# EAGLE design xiao-waveshare (EAGLE 9.6.2)
Xiao ESP32-C3 + Waveshare 4.2" E-ink Display Board
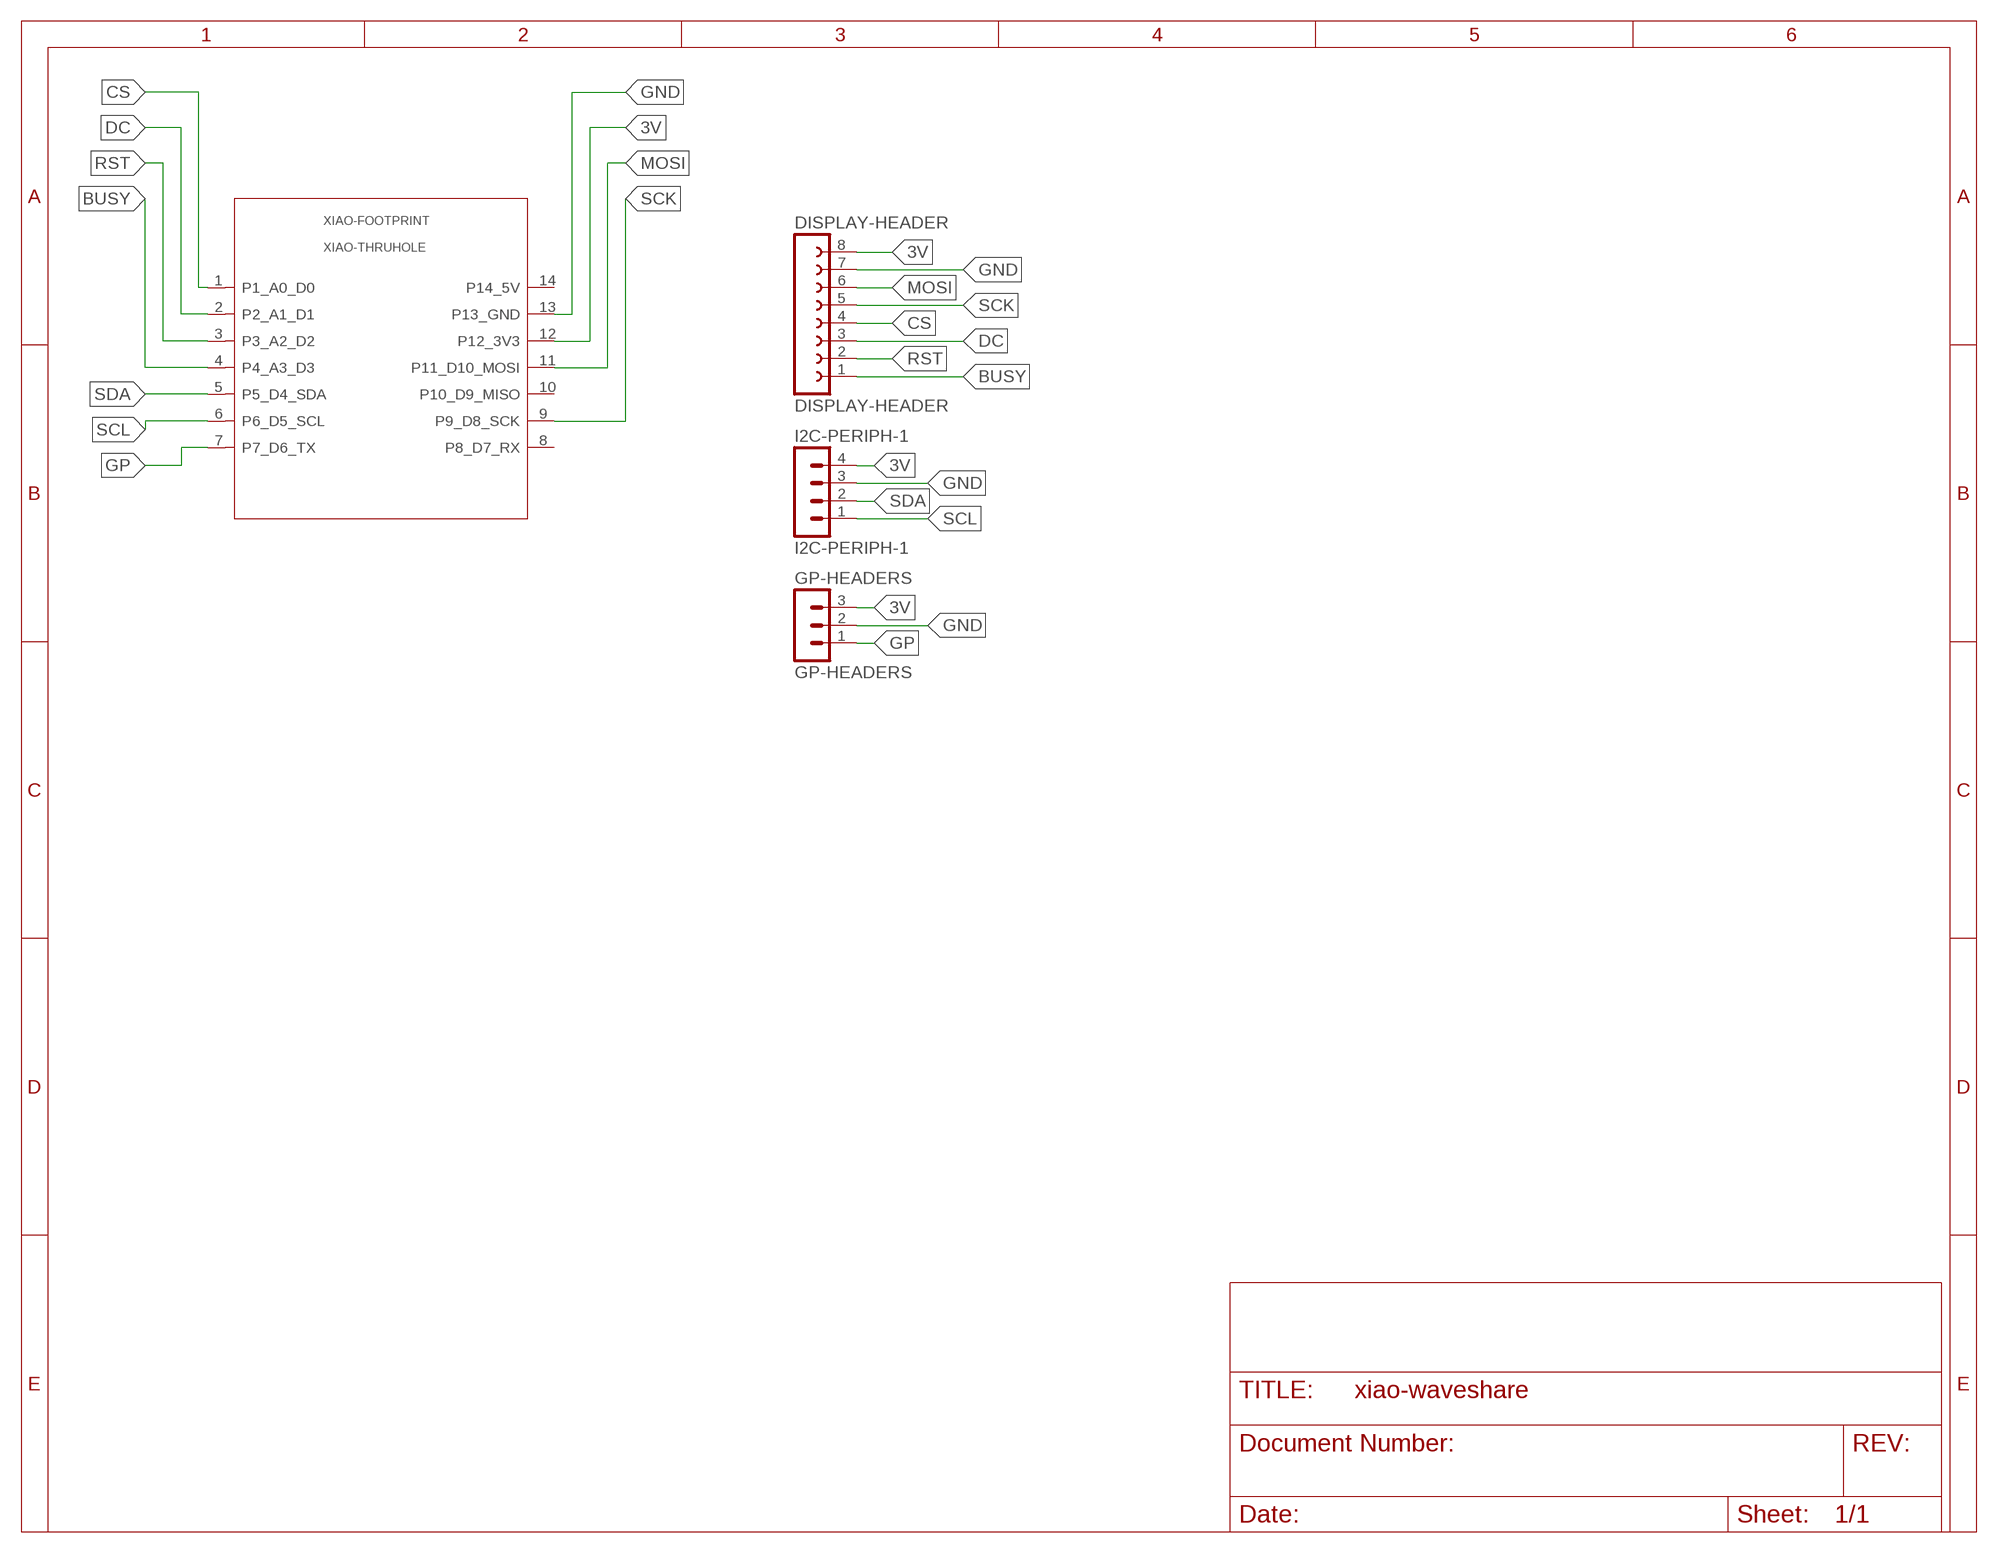
[diagram p0: schematic, sheet 1]

## Parts
DISPLAY-HEADER  DISPLAY-HEADER  FE08-1  [FE08]
GP-HEADERS  GP-HEADERS  MA03-1  [MA03-1]
I2C-PERIPH-1  I2C-PERIPH-1  MA04-1  [MA04-1]
XIAO-FOOTPRINT  XIAO-THRUHOLE  [XIAO-GENERIC-THRUHOLE-MODULE14P-2.54-21X17.8MM]

## Nets
3V [power]: DISPLAY-HEADER.8 GP-HEADERS.3 I2C-PERIPH-1.4 XIAO-FOOTPRINT.12(P12_3V3)
BUSY [signals]: DISPLAY-HEADER.1 XIAO-FOOTPRINT.4(P4_A3_D3)
CS [signals]: DISPLAY-HEADER.4 XIAO-FOOTPRINT.1(P1_A0_D0)
DC [signals]: DISPLAY-HEADER.3 XIAO-FOOTPRINT.2(P2_A1_D1)
GND [ground]: DISPLAY-HEADER.7 GP-HEADERS.2 I2C-PERIPH-1.3 XIAO-FOOTPRINT.13(P13_GND)
GP [signals]: GP-HEADERS.1 XIAO-FOOTPRINT.7(P7_D6_TX)
MOSI [signals]: DISPLAY-HEADER.6 XIAO-FOOTPRINT.11(P11_D10_MOSI)
RST [signals]: DISPLAY-HEADER.2 XIAO-FOOTPRINT.3(P3_A2_D2)
SCK [signals]: DISPLAY-HEADER.5 XIAO-FOOTPRINT.9(P9_D8_SCK)
SCL [signals]: I2C-PERIPH-1.1 XIAO-FOOTPRINT.6(P6_D5_SCL)
SDA [signals]: I2C-PERIPH-1.2 XIAO-FOOTPRINT.5(P5_D4_SDA)
Unconnected: XIAO-FOOTPRINT.8(P8_D7_RX) XIAO-FOOTPRINT.10(P10_D9_MISO) XIAO-FOOTPRINT.14(P14_5V)

## Library data of the parts
DISPLAY-HEADER = con-lsta:FE08-1: FEMALE HEADER; OC_FARNELL: unknown; OC_NEWARK: unknown
GP-HEADERS = con-lstb:MA03-1: PIN HEADER; OC_FARNELL: unknown; OC_NEWARK: unknown
I2C-PERIPH-1 = con-lstb:MA04-1: PIN HEADER; OC_FARNELL: unknown; OC_NEWARK: unknown
XIAO-FOOTPRINT = Seeed Studio XIAO Series:XIAO-THRUHOLE: Seeed Studio XIAO Series Through-hole Footprint and Symbol Basic through-hole footprint for Seeed XIAO series of boards. The underside surface mount pads are disabled. For through-hole mounting, a pair of 7-pin, 2.54mm pitch headers with 0.64x0.64mm square leads are recommended. The hybrid variant allows the assembler to choose between surface mount and through-hole mounting methods. However, there is a risk of solder leakage and therefore insufficient solder at the joints if soldering using solder paste and stencils, so we advise using this footprint only when the module is intended to be hand soldered. The symbol pin labels are generic. Please refer to the specific board for more information. Seeed Studio XIAO SAMD21 (Seeeduino XIAO) is also available pre-soldered: Seeed Studio XIAO SAMD21 Pre-soldered - Microchip ATSAMD21G18 Arduino Microcontroller with headers Seeed SKU: 102010388 Buy now <https://www.seeedstudio.com/Seeeduino-XIAO-Pre-Soldered-p-4747.html>

## Net classes
1 signals: width 0.406 mm
2 power: width 0.61 mm
3 ground: width 0.61 mm

## Board
Xiao ESP32-C3 + Waveshare 4.2" e-ink display
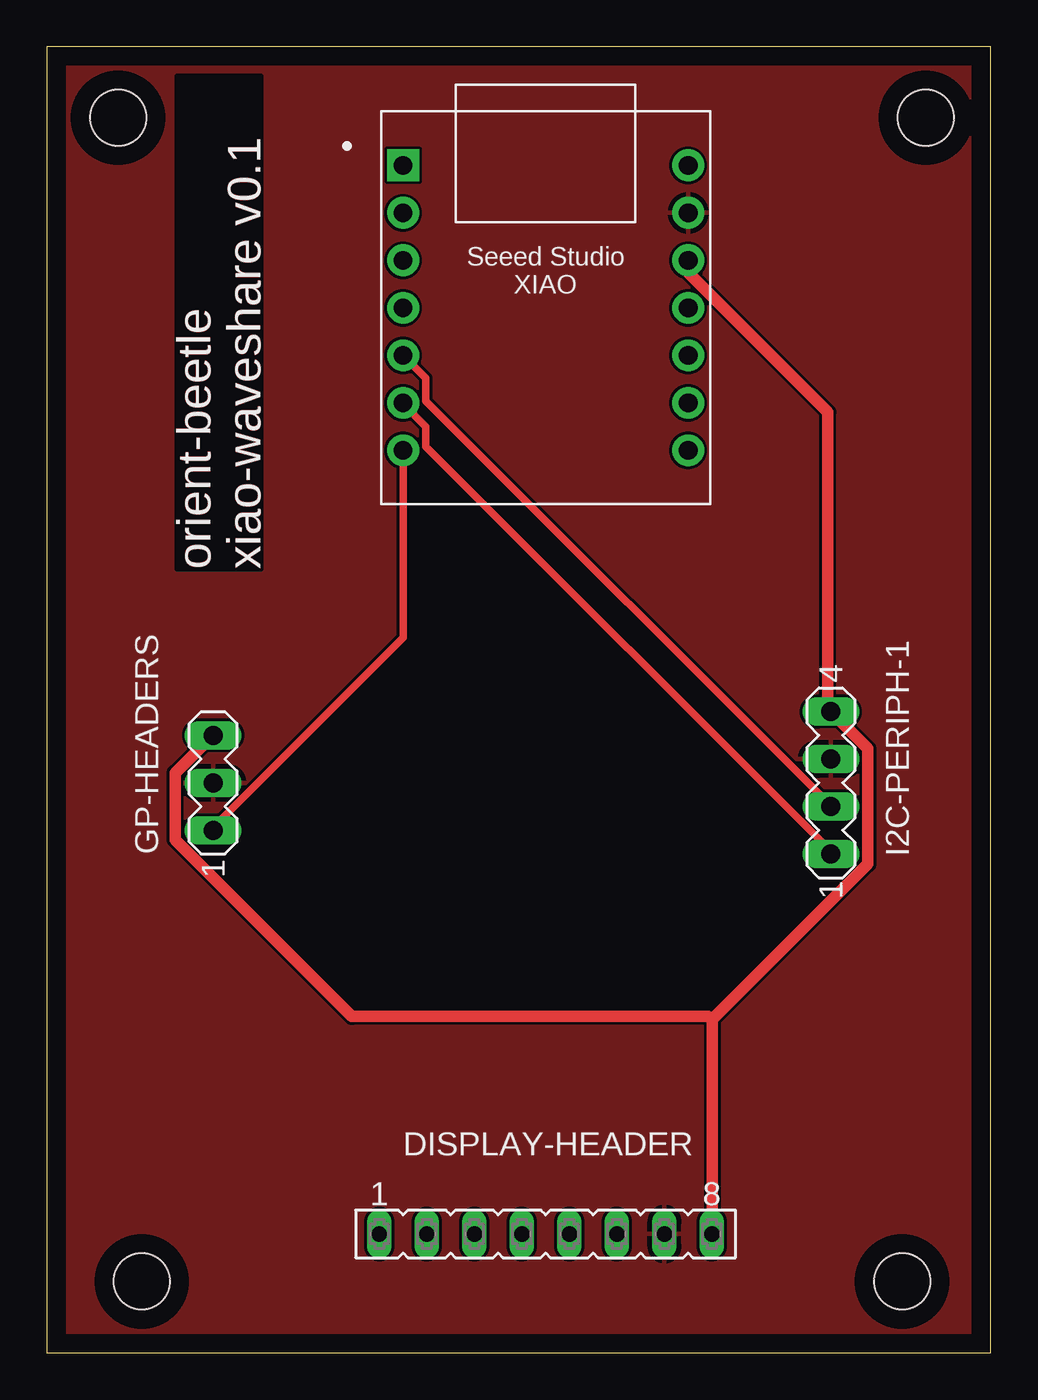
[diagram p1: board, top side]
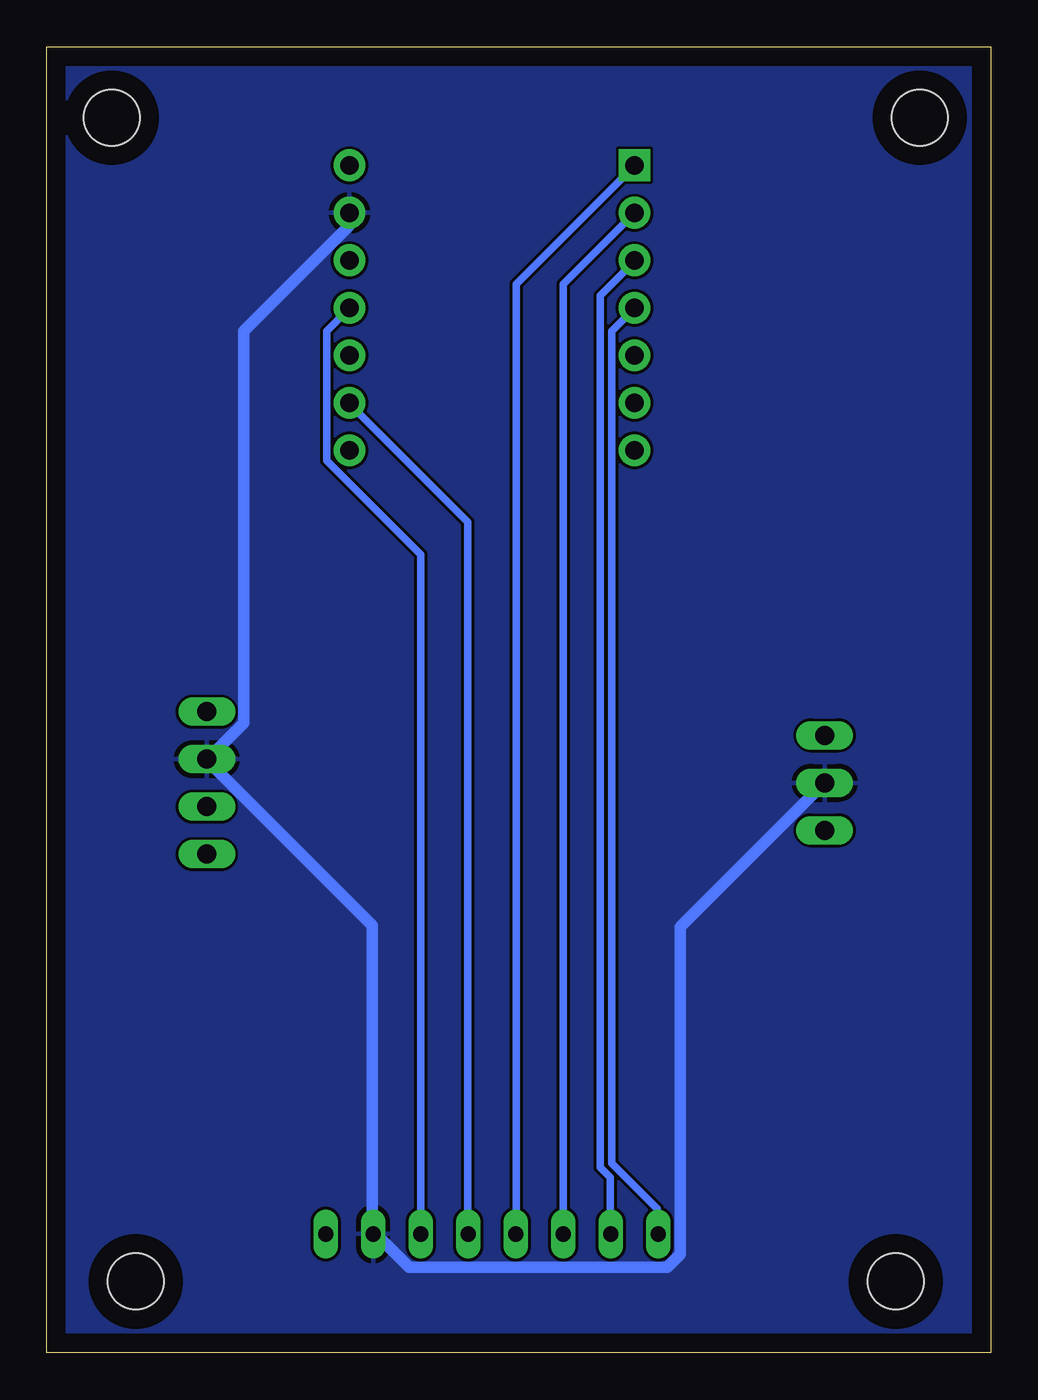
[diagram p2: board, bottom side, seen from below]

Size 50.47 x 69.84 mm. Coordinates in mm from the lower left corner, seen from the top.
Outline: 0,0 50.47,0 50.47,69.84 0,69.84 0,0
Copper layers (1*16): Top 0.035mm / dielectric 1.5mm / Bottom 0.035mm
Design rules "default": minimum track width 6mil, minimum drill 0.35mm, track to track 6mil, track to pad 6mil, pad to pad 6mil, via to via 6mil, smd to smd 6mil, copper to edge 40mil, drill to drill 6mil, minimum pad ring 10mil, minimum via ring 8mil, stop-mask expansion 4mil, vias tented up to drill 0mil, thermal gap 10mil
Holes 3 mm at 3.81,66.04 46.99,66.04 45.72,3.81 5.08,3.81

### Footprints (pad centres in the part's own frame; a part is rotated, then mirrored left to right if it is on the bottom)
FE08 = drill 0.813 long: 1 -8.89,0; 2 -6.35,0; 3 -3.81,0; 4 -1.27,0; 5 1.27,0; 6 3.81,0; 7 6.35,0; 8 8.89,0
MA03-1 = drill 1.016 long: 1 -2.54,0; 2 0,0; 3 2.54,0
MA04-1 = drill 1.016 long: 1 -3.81,0; 2 -1.27,0; 3 1.27,0; 4 3.81,0
XIAO-GENERIC-THRUHOLE-MODULE14P-2.54-21X17.8MM = drill 1 pad 1.7 square: 1 -7.62,7.62 | drill 1 pad 1.7: 2 -7.62,5.08; 3 -7.62,2.54; 4 -7.62,0; 5 -7.62,-2.54; 6 -7.62,-5.08; 7 -7.62,-7.62; 8 7.62,-7.62; 9 7.62,-5.08; 10 7.62,-2.54; 11 7.62,0; 12 7.62,2.54; 13 7.62,5.08; 14 7.62,7.62

### Placement (x,y rotation side)
DISPLAY-HEADER  26.67,6.35 0 top
GP-HEADERS  8.89,30.48 90 top
I2C-PERIPH-1  41.91,30.48 90 top
XIAO-FOOTPRINT  26.67,55.88 0 top

### Tracks (layer width: path | path; a pad name or v marks a point on that pad's centre or on a via)
3V
  Top 0.61: 35.59,17.83 35.59,6.4 DISPLAY-HEADER.8 | 35.59,17.83 43.89,26.14 43.89,32.31 I2C-PERIPH-1.4 41.76,34.52 41.76,50.29 34.29,57.76 XIAO-FOOTPRINT.12 | GP-HEADERS.3 8.84,32.99 6.86,31.01 6.86,27.43 16.31,17.98 35.36,17.98 35.59,17.83
BUSY
  Bottom 0.406: DISPLAY-HEADER.1 17.83,6.4 17.83,7.7 20.27,10.13 20.27,54.63 19.05,55.85 XIAO-FOOTPRINT.4
CS
  Bottom 0.406: DISPLAY-HEADER.4 25.38,6.4 25.38,57.15 19.05,63.48 XIAO-FOOTPRINT.1
DC
  Bottom 0.406: DISPLAY-HEADER.3 22.86,57.15 XIAO-FOOTPRINT.2
GND
  Bottom 0.61: GP-HEADERS.2 8.91,30.48 16.61,22.78 16.61,5.26 17.3,4.57 31.09,4.57 32.77,6.25 DISPLAY-HEADER.7 33.07,6.4 33.07,22.86 41.91,31.7 I2C-PERIPH-1.3 41.68,31.93 39.93,33.68 39.93,54.63 34.29,60.27 XIAO-FOOTPRINT.13
  pour Bottom: 0,69.85 50.8,69.85 50.8,0 0,0
  pour Top: 0,69.85 50.8,69.85 50.8,67.31 50.8,0 0,0
GP
  Top 0.406: XIAO-FOOTPRINT.7 19.05,38.25 8.91,28.12 8.91,27.96 GP-HEADERS.1
MOSI
  Bottom 0.406: DISPLAY-HEADER.6 30.48,42.67 35.51,47.7 35.51,54.63 34.29,55.85 XIAO-FOOTPRINT.11
RST
  Bottom 0.406: DISPLAY-HEADER.2 20.34,6.4 20.34,9.37 20.88,9.91 20.88,56.54 19.05,58.37 XIAO-FOOTPRINT.3
SCK
  Bottom 0.406: DISPLAY-HEADER.5 27.96,6.4 27.96,44.42 34.29,50.75 XIAO-FOOTPRINT.9
SCL
  Top 0.406: I2C-PERIPH-1.1 41.91,26.82 20.27,48.46 20.27,49.53 19.05,50.75 XIAO-FOOTPRINT.6
SDA
  Top 0.406: XIAO-FOOTPRINT.5 20.27,52.12 20.27,50.9 41.91,29.26 I2C-PERIPH-1.2

### Text on the board
Top: orient-beetle / xiao-waveshare v0.1
tNames: orient-beetle / xiao-waveshare v0.1